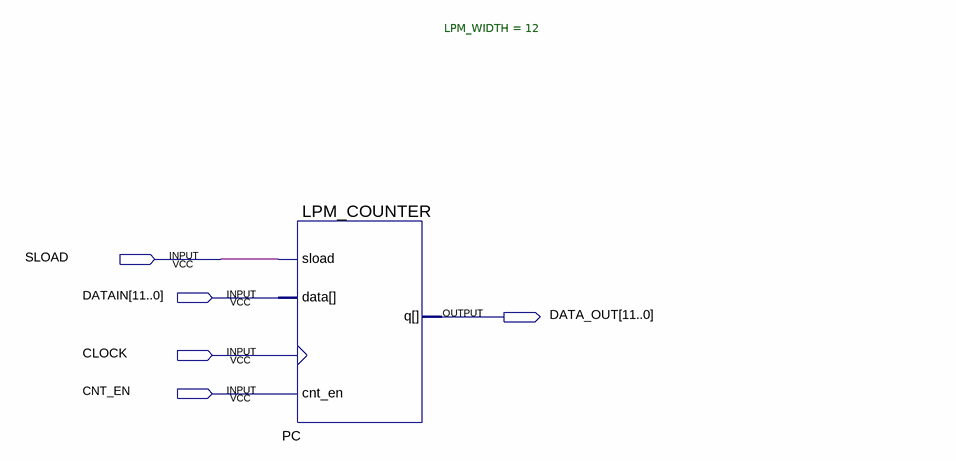
[diagram p0: schematic sheet]
// Quartus schematic TEST_LPM_COUNTER.bdf as structural Verilog: 1 symbols, 5 pins
module TEST_LPM_COUNTER (
  input  SLOAD,
  input  [11:0] DATAIN,
  input  CLOCK,
  input  CNT_EN,
  output [11:0] DATA_OUT
);

  LPM_COUNTER #(.LPM_WIDTH(12)) PC (.clock(CLOCK), .cnt_en(CNT_EN), .data(DATAIN), .sload(SLOAD), .q(DATA_OUT));
endmodule
